# EAGLE design zx48_to_128-EASY_3 (EAGLE 4.11)
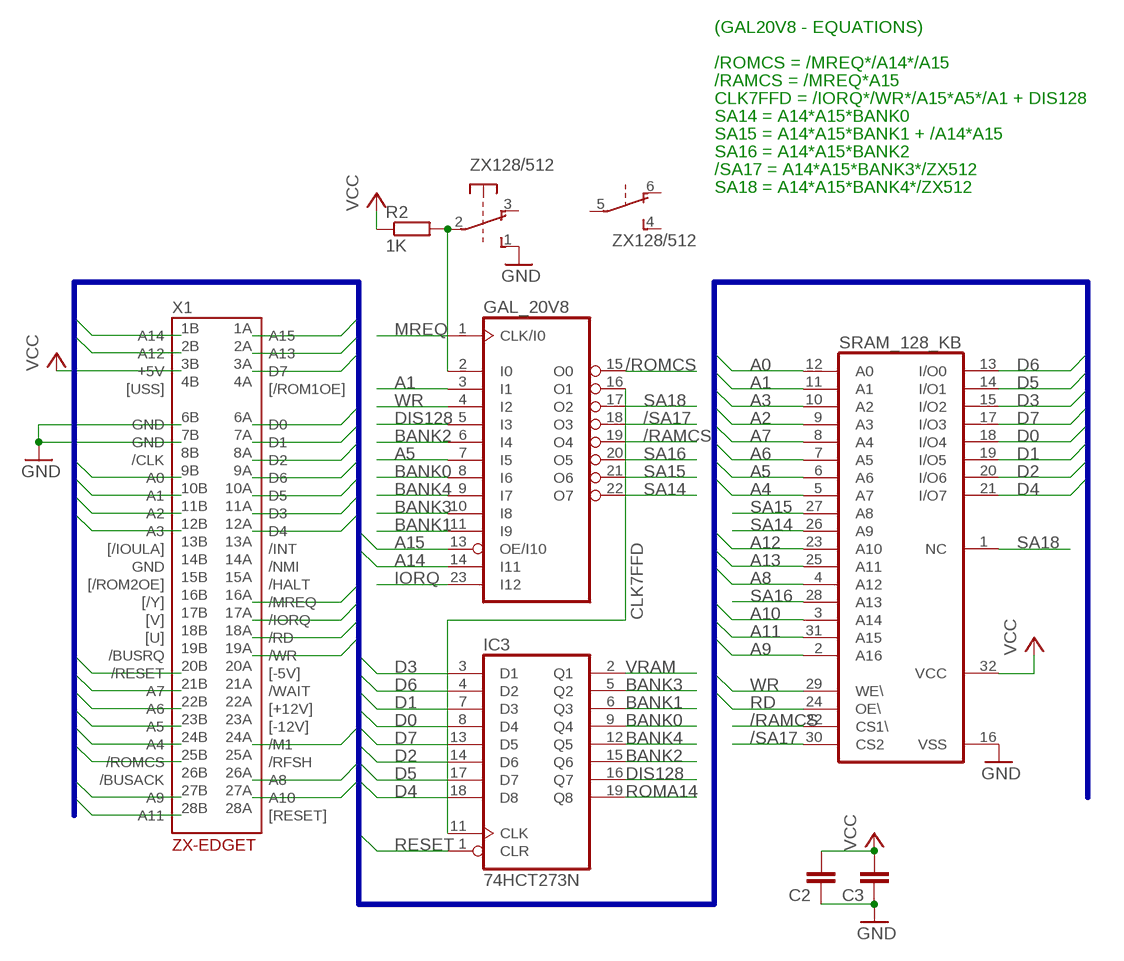
[diagram p0: schematic, sheet 1]

## Parts
C2  C-EU050-024X044  [C050-024X044]
C3  C-EU050-024X044  [C050-024X044]
GAL_20V8  20V8  [DIL24-3]
IC3  74HCT273N  [DIL20]
R2  1K  R-EU_0204/2V  [0204V]
SRAM_128_KB  628128P  [DIL32]
X1  ZX-EDGET  [ZX-THR]
ZX128/512  9077-2  [9077-2]

## Nets
/RAMCS: GAL_20V8.19(O4) SRAM_128_KB.22(CS1\)
/ROMCS: GAL_20V8.15(O0)
/SA17: GAL_20V8.18(O3) SRAM_128_KB.30(CS2)
A0: SRAM_128_KB.12(A0) X1.9B(A0)
A1: GAL_20V8.3(I1) SRAM_128_KB.11(A1) X1.10B(A1)
A2: SRAM_128_KB.9(A3) X1.11B(A2)
A3: SRAM_128_KB.10(A2) X1.12B(A3)
A4: SRAM_128_KB.5(A7) X1.24B(A4)
A5: GAL_20V8.7(I5) SRAM_128_KB.6(A6) X1.23B(A5)
A6: SRAM_128_KB.7(A5) X1.22B(A6)
A7: SRAM_128_KB.8(A4) X1.21B(A7)
A8: SRAM_128_KB.4(A12) X1.26A(A8)
A9: SRAM_128_KB.2(A16) X1.27B(A9)
A10: SRAM_128_KB.3(A14) X1.27A(A10)
A11: SRAM_128_KB.31(A15) X1.28B(A11)
A12: SRAM_128_KB.23(A10) X1.2B(A12)
A13: SRAM_128_KB.25(A11) X1.2A(A13)
A14: GAL_20V8.14(I11) X1.1B(A14)
A15: GAL_20V8.13(OE/I10) X1.1A(A15)
BANK0: GAL_20V8.8(I6) IC3.9(Q4)
BANK1: GAL_20V8.11(I9) IC3.6(Q3)
BANK2: GAL_20V8.6(I4) IC3.15(Q6)
BANK3: GAL_20V8.10(I8) IC3.5(Q2)
BANK4: GAL_20V8.9(I7) IC3.12(Q5)
CLK7FFD: GAL_20V8.16(O1) IC3.11(CLK)
D0: IC3.8(D4) SRAM_128_KB.18(I/O4) X1.6A(D0)
D1: IC3.7(D3) SRAM_128_KB.19(I/O5) X1.7A(D1)
D2: IC3.14(D6) SRAM_128_KB.20(I/O6) X1.8A(D2)
D3: IC3.3(D1) SRAM_128_KB.15(I/O2) X1.11A(D3)
D4: IC3.18(D8) SRAM_128_KB.21(I/O7) X1.12A(D4)
D5: IC3.17(D7) SRAM_128_KB.14(I/O1) X1.10A(D5)
D6: IC3.4(D2) SRAM_128_KB.13(I/O0) X1.9A(D6)
D7: IC3.13(D5) SRAM_128_KB.17(I/O3) X1.3A(D7)
DIS128: GAL_20V8.5(I3) IC3.16(Q7)
GND: C2.1 C3.1 SRAM_128_KB.16(VSS) X1.6B(GND) X1.7B(GND) ZX128/512.1(1:S)
IORQ: GAL_20V8.23(I12) X1.17A(/IORQ)
M1: X1.24A(/M1)
MREQ: GAL_20V8.1(CLK/I0) X1.16A(/MREQ)
N$1: GAL_20V8.2(I0) R2.2 ZX128/512.2(1:P)
RD: SRAM_128_KB.24(OE\) X1.18A(/RD)
RESET: IC3.1(CLR) X1.20B(/RESET)
ROMA14: IC3.19(Q8)
ROMCS: X1.25B(/ROMCS)
SA14: GAL_20V8.22(O7) SRAM_128_KB.26(A9)
SA15: GAL_20V8.21(O6) SRAM_128_KB.27(A8)
SA16: GAL_20V8.20(O5) SRAM_128_KB.28(A13)
SA18: GAL_20V8.17(O2) SRAM_128_KB.1(NC)
VCC: C2.2 C3.2 R2.1 SRAM_128_KB.32(VCC) X1.3B(+5V)
VRAM: IC3.2(Q1)
WR: GAL_20V8.4(I2) SRAM_128_KB.29(WE\) X1.19A(/WR)
Unconnected: X1.4A([/ROM1OE]) X1.4B([USS]) X1.8B(/CLK) X1.13A(/INT) X1.13B([/IOULA]) X1.14A(/NMI) X1.14B(GND) X1.15A(/HALT) X1.15B([/ROM2OE]) X1.16B([/Y]) X1.17B([V]) X1.18B([U]) X1.19B(/BUSRQ) X1.20A([-5V]) X1.21A(/WAIT) X1.22A([+12V]) X1.23A([-12V]) X1.25A(/RFSH) X1.26B(/BUSACK) X1.28A([RESET]) ZX128/512.3(1:O) ZX128/512.4(2:S) ZX128/512.5(2:P) ZX128/512.6(2:O)

## Buses
A[0..15],D[0..7],MREQ,IORQ,RD,WR,M1,ROMCS,RESET

## Notes on the sheet
- (GAL20V8 - EQUATIONS)
- /ROMCS = /MREQ*/A14*/A15
- /RAMCS = /MREQ*A15
- CLK7FFD = /IORQ*/WR*/A15*A5*/A1 + DIS128
- SA14 = A14*A15*BANK0
- SA15 = A14*A15*BANK1 + /A14*A15
- SA16 = A14*A15*BANK2
- /SA17 = A14*A15*BANK3*/ZX512
- SA18 = A14*A15*BANK4*/ZX512

## Power pins joined to a net without a drawn wire
GND: GAL_20V8.12(GND) IC3.10(GND)
VCC: GAL_20V8.24(VCC) IC3.20(VCC)

## Library data of the parts
C2 C3 = rcl:C-EU: CAPACITOR, European symbol
GAL_20V8 = pal:20V8: PAL
IC3 = 74xx-eu:74*273: Octal D type FLIP FLOP, clear
R2 = rcl:R-EU_: RESISTOR, European symbol
SRAM_128_KB = memory-hitachi:628128P: MEMORY
X1 = yabus:ZX-EDGE: Opposite part for ZX-Spectrum system bus
ZX128/512 = switch-misc:9077-2: MARQUARDT SWITCH

## Board
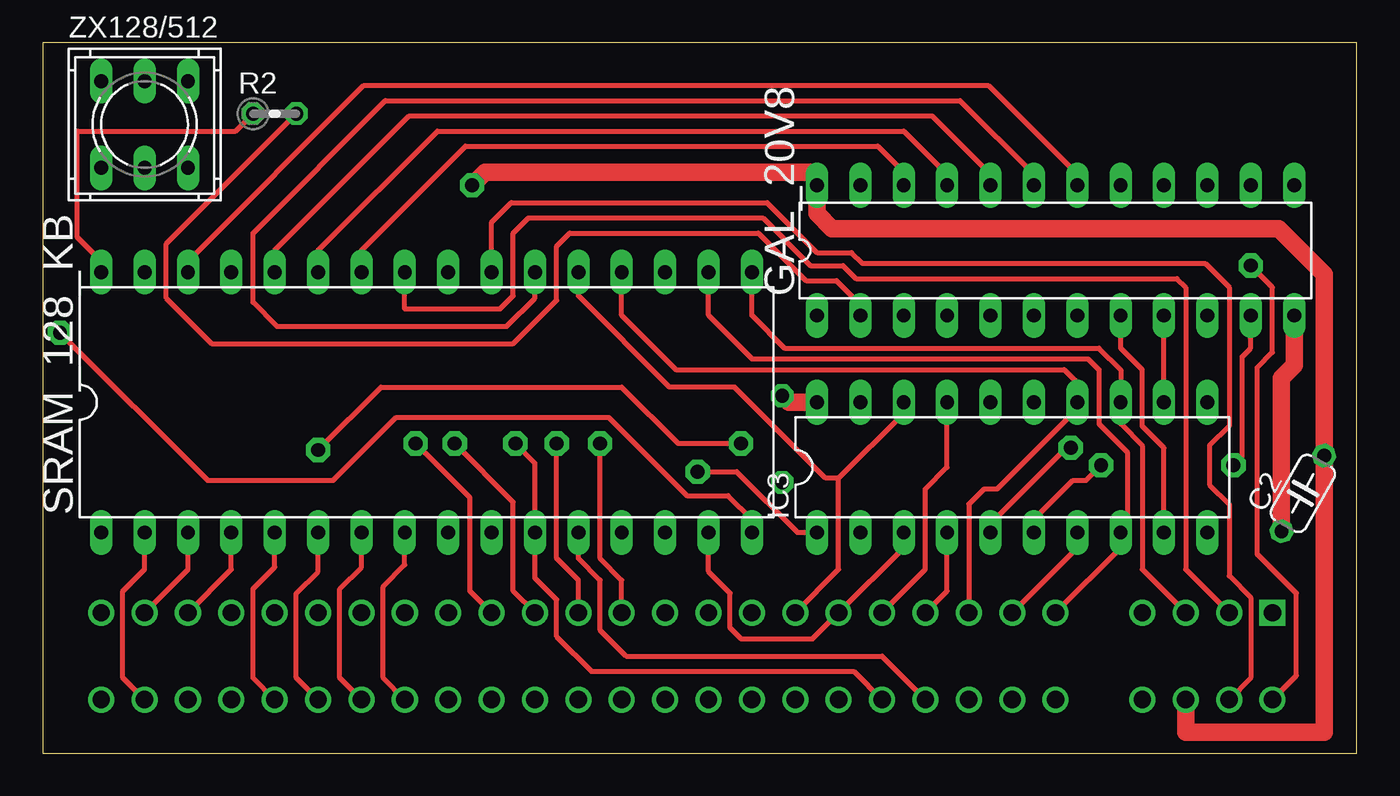
[diagram p1: board, top side]
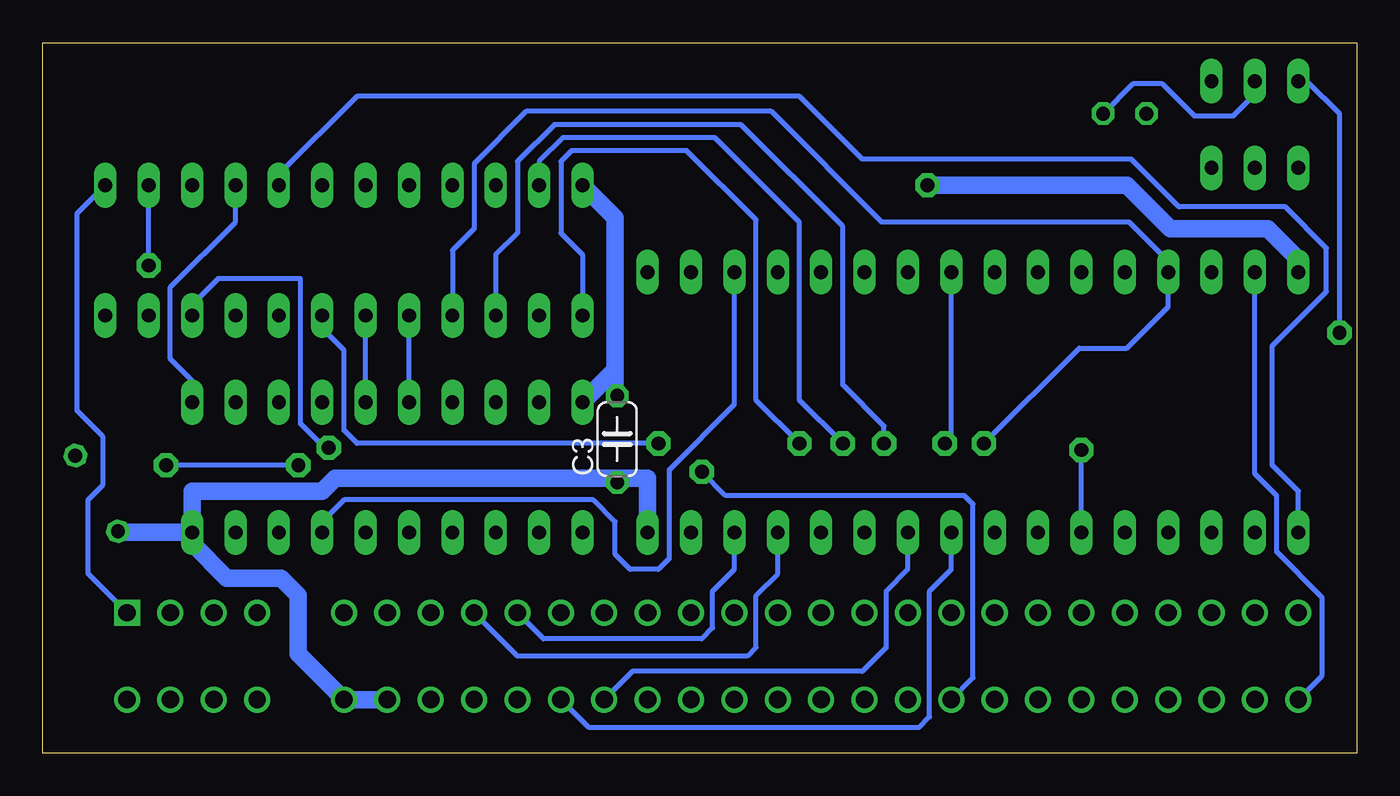
[diagram p2: board, bottom side, seen from below]

Size 76.94 x 41.58 mm. Coordinates in mm from the lower left corner, seen from the top.
Outline: 0,0 76.94,0 76.94,41.58 0,41.58 0,0
Copper layers (1*16): Top 0.035mm / dielectric 1.5mm / Bottom 0.035mm
Design rules "default": minimum track width 10mil, minimum drill 24mil, track to track 8mil, track to pad 8mil, pad to pad 8mil, via to via 8mil, smd to smd 8mil, copper to edge 40mil, drill to drill 8mil, minimum pad ring 10mil, minimum via ring 8mil, stop-mask expansion 4mil, vias tented up to drill 0mil, thermal gap 10mil

### Footprints (pad centres in the part's own frame; a part is rotated, then mirrored left to right if it is on the bottom)
C050-024X044 = drill 0.813 octagon: 1 -2.54,0; 2 2.54,0
DIL24-3 = drill 0.813 long: 1 -13.97,-3.81; 2 -11.43,-3.81; 3 -8.89,-3.81; 4 -6.35,-3.81; 5 -3.81,-3.81; 6 -1.27,-3.81; 7 1.27,-3.81; 8 3.81,-3.81; 9 6.35,-3.81; 10 8.89,-3.81; 11 11.43,-3.81; 12 13.97,-3.81; 13 13.97,3.81; 14 11.43,3.81; 15 8.89,3.81; 16 6.35,3.81; 17 3.81,3.81; 18 1.27,3.81; 19 -1.27,3.81; 20 -3.81,3.81; 21 -6.35,3.81; 22 -8.89,3.81; 23 -11.43,3.81; 24 -13.97,3.81
DIL20 = drill 0.813 long: 1 -11.43,-3.81; 2 -8.89,-3.81; 3 -6.35,-3.81; 4 -3.81,-3.81; 5 -1.27,-3.81; 6 1.27,-3.81; 7 3.81,-3.81; 8 6.35,-3.81; 9 8.89,-3.81; 10 11.43,-3.81; 11 11.43,3.81; 12 8.89,3.81; 13 6.35,3.81; 14 3.81,3.81; 15 1.27,3.81; 16 -1.27,3.81; 17 -3.81,3.81; 18 -6.35,3.81; 19 -8.89,3.81; 20 -11.43,3.81
0204V = drill 0.813 octagon: 1 -1.27,0; 2 1.27,0
DIL32 = drill 0.813 long: 1 -19.05,-7.62; 2 -16.51,-7.62; 3 -13.97,-7.62; 4 -11.43,-7.62; 5 -8.89,-7.62; 6 -6.35,-7.62; 7 -3.81,-7.62; 8 -1.27,-7.62; 9 1.27,-7.62; 10 3.81,-7.62; 11 6.35,-7.62; 12 8.89,-7.62; 13 11.43,-7.62; 14 13.97,-7.62; 15 16.51,-7.62; 16 19.05,-7.62; 17 19.05,7.62; 18 16.51,7.62; 19 13.97,7.62; 20 11.43,7.62; 21 8.89,7.62; 22 6.35,7.62; 23 3.81,7.62; 24 1.27,7.62; 25 -1.27,7.62; 26 -3.81,7.62; 27 -6.35,7.62; 28 -8.89,7.62; 29 -11.43,7.62; 30 -13.97,7.62; 31 -16.51,7.62; 32 -19.05,7.62
ZX-THR = drill 1.016 square: 1A -34.29,2.54 | drill 1.016 round: 1B -34.29,-2.54; 2A -31.75,2.54; 2B -31.75,-2.54; 3A -29.21,2.54; 3B -29.21,-2.54; 4A -26.67,2.54; 4B -26.67,-2.54; 6A -21.59,2.54; 6B -21.59,-2.54; 7A -19.05,2.54; 7B -19.05,-2.54; 8A -16.51,2.54; 8B -16.51,-2.54; 9A -13.97,2.54; 9B -13.97,-2.54; 10A -11.43,2.54; 10B -11.43,-2.54; 11A -8.89,2.54; 11B -8.89,-2.54; 12A -6.35,2.54; 12B -6.35,-2.54; 13A -3.81,2.54; 13B -3.81,-2.54; 14A -1.27,2.54; 14B -1.27,-2.54; 15A 1.27,2.54; 15B 1.27,-2.54; 16A 3.81,2.54; 16B 3.81,-2.54; 17A 6.35,2.54; 17B 6.35,-2.54; 18A 8.89,2.54; 18B 8.89,-2.54; 19A 11.43,2.54; 19B 11.43,-2.54; 20A 13.97,2.54; 20B 13.97,-2.54; 21A 16.51,2.54; 21B 16.51,-2.54; 22A 19.05,2.54; 22B 19.05,-2.54; 23A 21.59,2.54; 23B 21.59,-2.54; 24A 24.13,2.54; 24B 24.13,-2.54; 25A 26.67,2.54; 25B 26.67,-2.54; 26A 29.21,2.54; 26B 29.21,-2.54; 27A 31.75,2.54; 27B 31.75,-2.54; 28A 34.29,2.54; 28B 34.29,-2.54
9077-2 = drill 0.813 long: 1 -2.54,2.54; 2 0,2.54; 3 2.54,2.54; 4 -2.54,-2.54; 5 0,-2.54; 6 2.54,-2.54

### Placement (x,y rotation side)
C2  73.78,15.2 60.6 top
C3  43.3,18.38 90 bottom
GAL_20V8  59.3,29.43 0 top
IC3  56.76,16.73 0 top
R2  13.58,37.43 0 top
SRAM_128_KB  22.47,20.54 0 top
X1  37.71,5.68 0 bottom
ZX128/512  5.96,36.79 0 top

### Tracks (layer width: path | path; a pad name or v marks a point on that pad's centre or on a via)
/RAMCS
  Top 0.305: GAL_20V8.19 58.03,33.87 53.72,38.19 20.06,38.19 12.31,30.44 12.31,26.38 13.71,24.98 27.17,24.98 28.82,26.63 SRAM_128_KB.22
/SA17
  Top 0.305: GAL_20V8.18 60.57,33.87 55.37,39.08 18.79,39.08 8.5,28.79 SRAM_128_KB.30
A0
  Top 0.305: SRAM_128_KB.12 31.36,11.39 32.63,10.12 32.63,7.2 34.16,5.68 49.14,5.68 X1.9B
A1  (via drill 0.81 pad 1.42)
  Top 0.305: v27.68,18.12 28.82,16.98 SRAM_128_KB.11 28.82,10.25 30.09,8.98 30.09,6.82 32.13,4.79 47.49,4.79 X1.10B
  Bottom 0.305: GAL_20V8.3 50.41,29.17 49.14,30.44 49.14,34.63 46.98,36.79 36.06,36.79 30.09,30.82 30.09,21.55 27.68,19.14 v27.68,18.12
A2
  Bottom 0.305: SRAM_128_KB.9 23.74,10.76 25.01,9.49 25.01,2.12 25.65,1.49 44.95,1.49 X1.11B
A3
  Bottom 0.305: SRAM_128_KB.10 26.28,10.76 27.55,9.49 27.55,6.18 28.95,4.79 42.41,4.79 X1.12B
A4
  Top 0.305: SRAM_128_KB.5 13.58,10.88 12.31,9.61 12.31,4.41 X1.24B
A5  (via drill 0.81 pad 1.42)
  Top 0.305: v40.89,18.12 37.21,18.12 33.9,21.42 19.81,21.42 v16.12,17.74 | SRAM_128_KB.6 16.12,10.63 14.85,9.36 14.85,4.41 X1.23B
  Bottom 0.305: GAL_20V8.7 60.57,24.85 59.3,23.58 59.3,18.88 58.54,18.12 v40.89,18.12 | SRAM_128_KB.6 v16.12,17.74
A6
  Top 0.305: X1.22B 17.39,4.41 17.39,9.61 18.66,10.88 SRAM_128_KB.7
A7
  Top 0.305: X1.21B 19.93,4.41 19.93,9.74 21.2,11.01 SRAM_128_KB.8
A8
  Top 0.305: SRAM_128_KB.4 11.04,10.76 X1.26A
A9
  Top 0.305: SRAM_128_KB.2 5.96,10.76 4.69,9.49 4.69,4.41 X1.27B
A10
  Top 0.305: SRAM_128_KB.3 8.5,10.76 X1.27A
A11
  Bottom 0.305: SRAM_128_KB.31 5.96,16.34 4.69,15.07 4.69,11.77 2.03,9.11 2.03,4.53 X1.28B
A12
  Top 0.305: SRAM_128_KB.23 26.28,31.08 27.43,32.22 42.41,32.22 45.33,29.3 47.37,29.3 48,28.66 68.07,28.66 69.46,27.27 69.46,19.14 68.32,18 68.32,15.71 69.46,14.57 69.46,10.38 70.73,9.11 70.73,4.41 X1.2B
A13
  Top 0.305: SRAM_128_KB.25 21.2,26 26.79,26 27.55,26.76 27.55,30.44 28.44,31.33 42.16,31.33 44.95,28.54 46.86,28.54 47.62,27.77 66.42,27.77 66.92,27.27 66.92,10.76 X1.2A
A14  (via drill 0.81 pad 1.42)
  Top 0.305: v70.73,28.54 72,27.27 72,23.46 71.12,22.57 71.12,11.65 73.4,9.36 73.4,4.53 X1.1B
  Bottom 0.305: v70.73,28.54 GAL_20V8.14
A15
  Bottom 0.305: GAL_20V8.13 74.93,31.59 74.93,20.03 73.4,18.5 73.4,15.71 74.29,14.82 74.29,10.5 X1.1A
BANK0
  Top 0.305: IC3.9 65.65,17.87 64.38,19.14 64.38,22.44 63.11,23.71 GAL_20V8.8
BANK1  (via drill 0.81 pad 1.42)
  Top 0.305: GAL_20V8.11 70.73,23.71 70.23,23.2 70.23,17.36 v69.72,16.85 | IC3.6 58.03,13.68 60.32,15.96 61.08,15.96 v61.97,16.85
  Bottom 0.305: v61.97,16.85 v69.72,16.85
BANK2
  Bottom 0.305: IC3.15 GAL_20V8.6
BANK3  (via drill 0.81 pad 1.42)
  Top 0.305: IC3.5 55.49,13.42 59.94,17.87 v60.19,17.87
  Bottom 0.305: v60.19,17.87 60.45,17.87 61.84,19.27 61.84,27.77 66.67,27.77 68.19,26.25 GAL_20V8.10
BANK4
  Top 0.305: IC3.12 GAL_20V8.9
CLK7FFD
  Bottom 0.305: IC3.11 68.19,21.81 69.46,23.08 69.46,27.27 65.65,31.08 GAL_20V8.16
D0
  Top 0.305: SRAM_128_KB.18 38.98,25.62 41.52,23.08 61.21,23.08 61.84,22.44 61.84,19.27 63.49,17.62 63.49,13.93 63.11,13.55 IC3.8 63.11,12.03 X1.6A
D1
  Top 0.305: IC3.7 60.57,12.03 X1.7A
  Bottom 0.305: IC3.7 60.57,13.55 59.3,14.82 44.7,14.82 43.43,13.55 43.43,11.65 42.54,10.76 40.89,10.76 40.25,11.39 40.25,16.6 36.44,20.41 SRAM_128_KB.19
D2
  Top 0.305: SRAM_128_KB.20 33.9,25.62 37.08,22.44 59.81,22.44 60.57,21.68 IC3.14 60.57,20.16 55.88,15.46 55.11,15.46 54.22,14.57 X1.8A
D3
  Top 0.305: IC3.3 50.41,12.03 X1.11A 45.08,6.69 40.89,6.69 40.25,7.33 40.25,9.36 38.98,10.63 SRAM_128_KB.15
D4
  Top 0.305: 46.6,16.09 50.41,19.9 IC3.18 | SRAM_128_KB.21 31.36,26.76 36.7,21.42 40.51,21.42 45.84,16.09 46.6,16.09 | X1.12A 46.6,10.76 46.6,16.09
D5
  Top 0.305: IC3.17 52.95,16.73 51.68,15.46 51.68,10.76 X1.10A
  Bottom 0.305: SRAM_128_KB.14 36.44,10.76 37.71,9.49 37.71,7.33 38.35,6.69 47.62,6.69 X1.10A
D6
  Top 0.305: IC3.4 52.95,9.49 X1.9A
  Bottom 0.305: SRAM_128_KB.13 33.9,10.5 35.17,9.23 35.17,6.18 35.68,5.68 49.14,5.68 X1.9A
D7
  Top 0.305: SRAM_128_KB.17 41.52,25.62 43.43,23.71 61.84,23.71 63.11,22.44 IC3.13 63.11,19.27 64.38,18 64.38,10.76 X1.3A
DIS128
  Bottom 0.305: IC3.16 GAL_20V8.5
GND  (via drill 0.81 pad 1.42)
  Top 0.305: SRAM_128_KB.16 41.52,13.68 40.13,15.07 37.71,15.07 33.14,19.65 20.7,19.65 17.01,15.96 9.65,15.96 v1.01,24.6
  Top 1.016: GAL_20V8.12 73.27,22.7 72.51,21.93 72.51,12.97 | 72.51,12.97 72.51,12.92 | C2.1 72.51,12.97
  Bottom 0.305: v1.01,24.6 1.01,37.43 2.92,39.33 ZX128/512.1
  Bottom 1.016: SRAM_128_KB.16 41.52,16.09 43.3,16.09 | 43.3,16.09 59.81,16.09 60.57,15.33 68.19,15.33 IC3.10 | IC3.10 72.51,12.92 72.51,12.97 C2.1 | 43.3,16.09 C3.1 | X1.7B X1.6B 61.97,5.8 61.97,9.23 62.99,10.25 66.16,10.25 68.19,12.28 IC3.10
IORQ  (via drill 0.81 pad 1.42)
  Top 0.305: X1.17A 31.36,10.12 30.09,11.39 v30.09,18.12
  Bottom 0.305: v30.09,18.12 32.63,20.66 32.63,31.08 37.59,36.03 46.48,36.03 47.87,34.63 GAL_20V8.23
MREQ  (via drill 0.81 pad 1.42)
  Top 0.305: X1.16A 33.9,10.12 32.63,11.39 v32.63,18.12
  Bottom 0.305: v32.63,18.12 35.17,20.66 35.17,31.2 39.24,35.27 45.97,35.27 46.6,34.63 46.6,30.44 45.33,29.17 GAL_20V8.1
N$1
  Top 0.305: GAL_20V8.2 47.87,26.25 46.48,27.65 44.7,27.65 41.9,30.44 30.86,30.44 30.09,29.68 30.09,26.51 27.55,23.97 9.9,23.97 7.23,26.63 7.23,29.81 R2.2
  Bottom 0.305: R2.2 13.08,39.2 11.42,39.2 9.52,37.3 7.23,37.3 5.96,38.57 ZX128/512.2
RD  (via drill 0.81 pad 1.42)
  Top 0.305: X1.18A 27.55,9.49 27.55,14.69 v24.12,18.12
  Bottom 0.305: v24.12,18.12 23.74,18.5 SRAM_128_KB.24
RESET  (via drill 0.81 pad 1.42)
  Top 0.305: IC3.1 44.19,12.92 40.63,16.47 v38.35,16.47
  Bottom 0.305: v38.35,16.47 36.95,15.07 22.98,15.07 22.47,14.57 22.47,4.41 X1.20B
SA14
  Top 0.305: GAL_20V8.22 50.41,34 48.89,35.52 24.76,35.52 18.66,29.43 SRAM_128_KB.26
SA15
  Top 0.305: GAL_20V8.21 52.95,33.87 50.41,36.41 23.11,36.41 16.12,29.43 SRAM_128_KB.27
SA16
  Top 0.305: GAL_20V8.20 55.49,33.87 52.06,37.3 21.46,37.3 13.58,29.43 SRAM_128_KB.28
SA18
  Bottom 0.305: GAL_20V8.17 63.11,33.87 58.54,38.44 32.63,38.44 28.95,34.76 13.2,34.76 10.41,31.97 4.19,31.97 1.77,29.55 1.77,27.01 4.95,23.84 4.95,16.85 3.42,15.33 SRAM_128_KB.1
VCC  (via drill 0.81 pad 1.42)
  Top 0.305: R2.1 11.3,36.41 2.03,36.41 2.03,30.19 3.42,28.79 SRAM_128_KB.32
  Top 1.016: v25.14,33.24 25.9,34 45.21,34 45.33,33.87 GAL_20V8.24 45.33,31.59 46.22,30.7 72.39,30.7 75.05,28.03 75.05,17.44 C2.2 75.05,16.8 75.05,1.23 66.92,1.23 X1.3B | C3.2 43.68,20.54 IC3.20
  Bottom 1.016: GAL_20V8.24 43.43,31.33 43.43,22.44 | 43.43,22.44 IC3.20 | v25.14,33.24 13.46,33.24 10.92,30.7 5.2,30.7 3.42,28.92 SRAM_128_KB.32 | C3.2 43.43,21.04 43.43,22.44
WR  (via drill 0.81 pad 1.42)
  Top 0.305: X1.19A 25.01,9.49 25.01,14.95 v21.84,18.12
  Bottom 0.305: GAL_20V8.4 52.95,29.43 51.68,30.7 51.68,34.51 48.64,37.55 34.28,37.55 27.81,31.08 13.33,31.08 11.04,28.79 SRAM_128_KB.29 11.04,26.12 13.46,23.71 16.25,23.71 v21.84,18.12